# Altium schematic sheet PowerBoard_1.SchDoc: DriveHUB CardFrame - Backplane Power
size A3; Date: 01/08/22; Engineer: AJC; DocumentNumber: 35-735; Revision: D; SheetNumber: 1; SheetTotal: 3; Manager: AJC
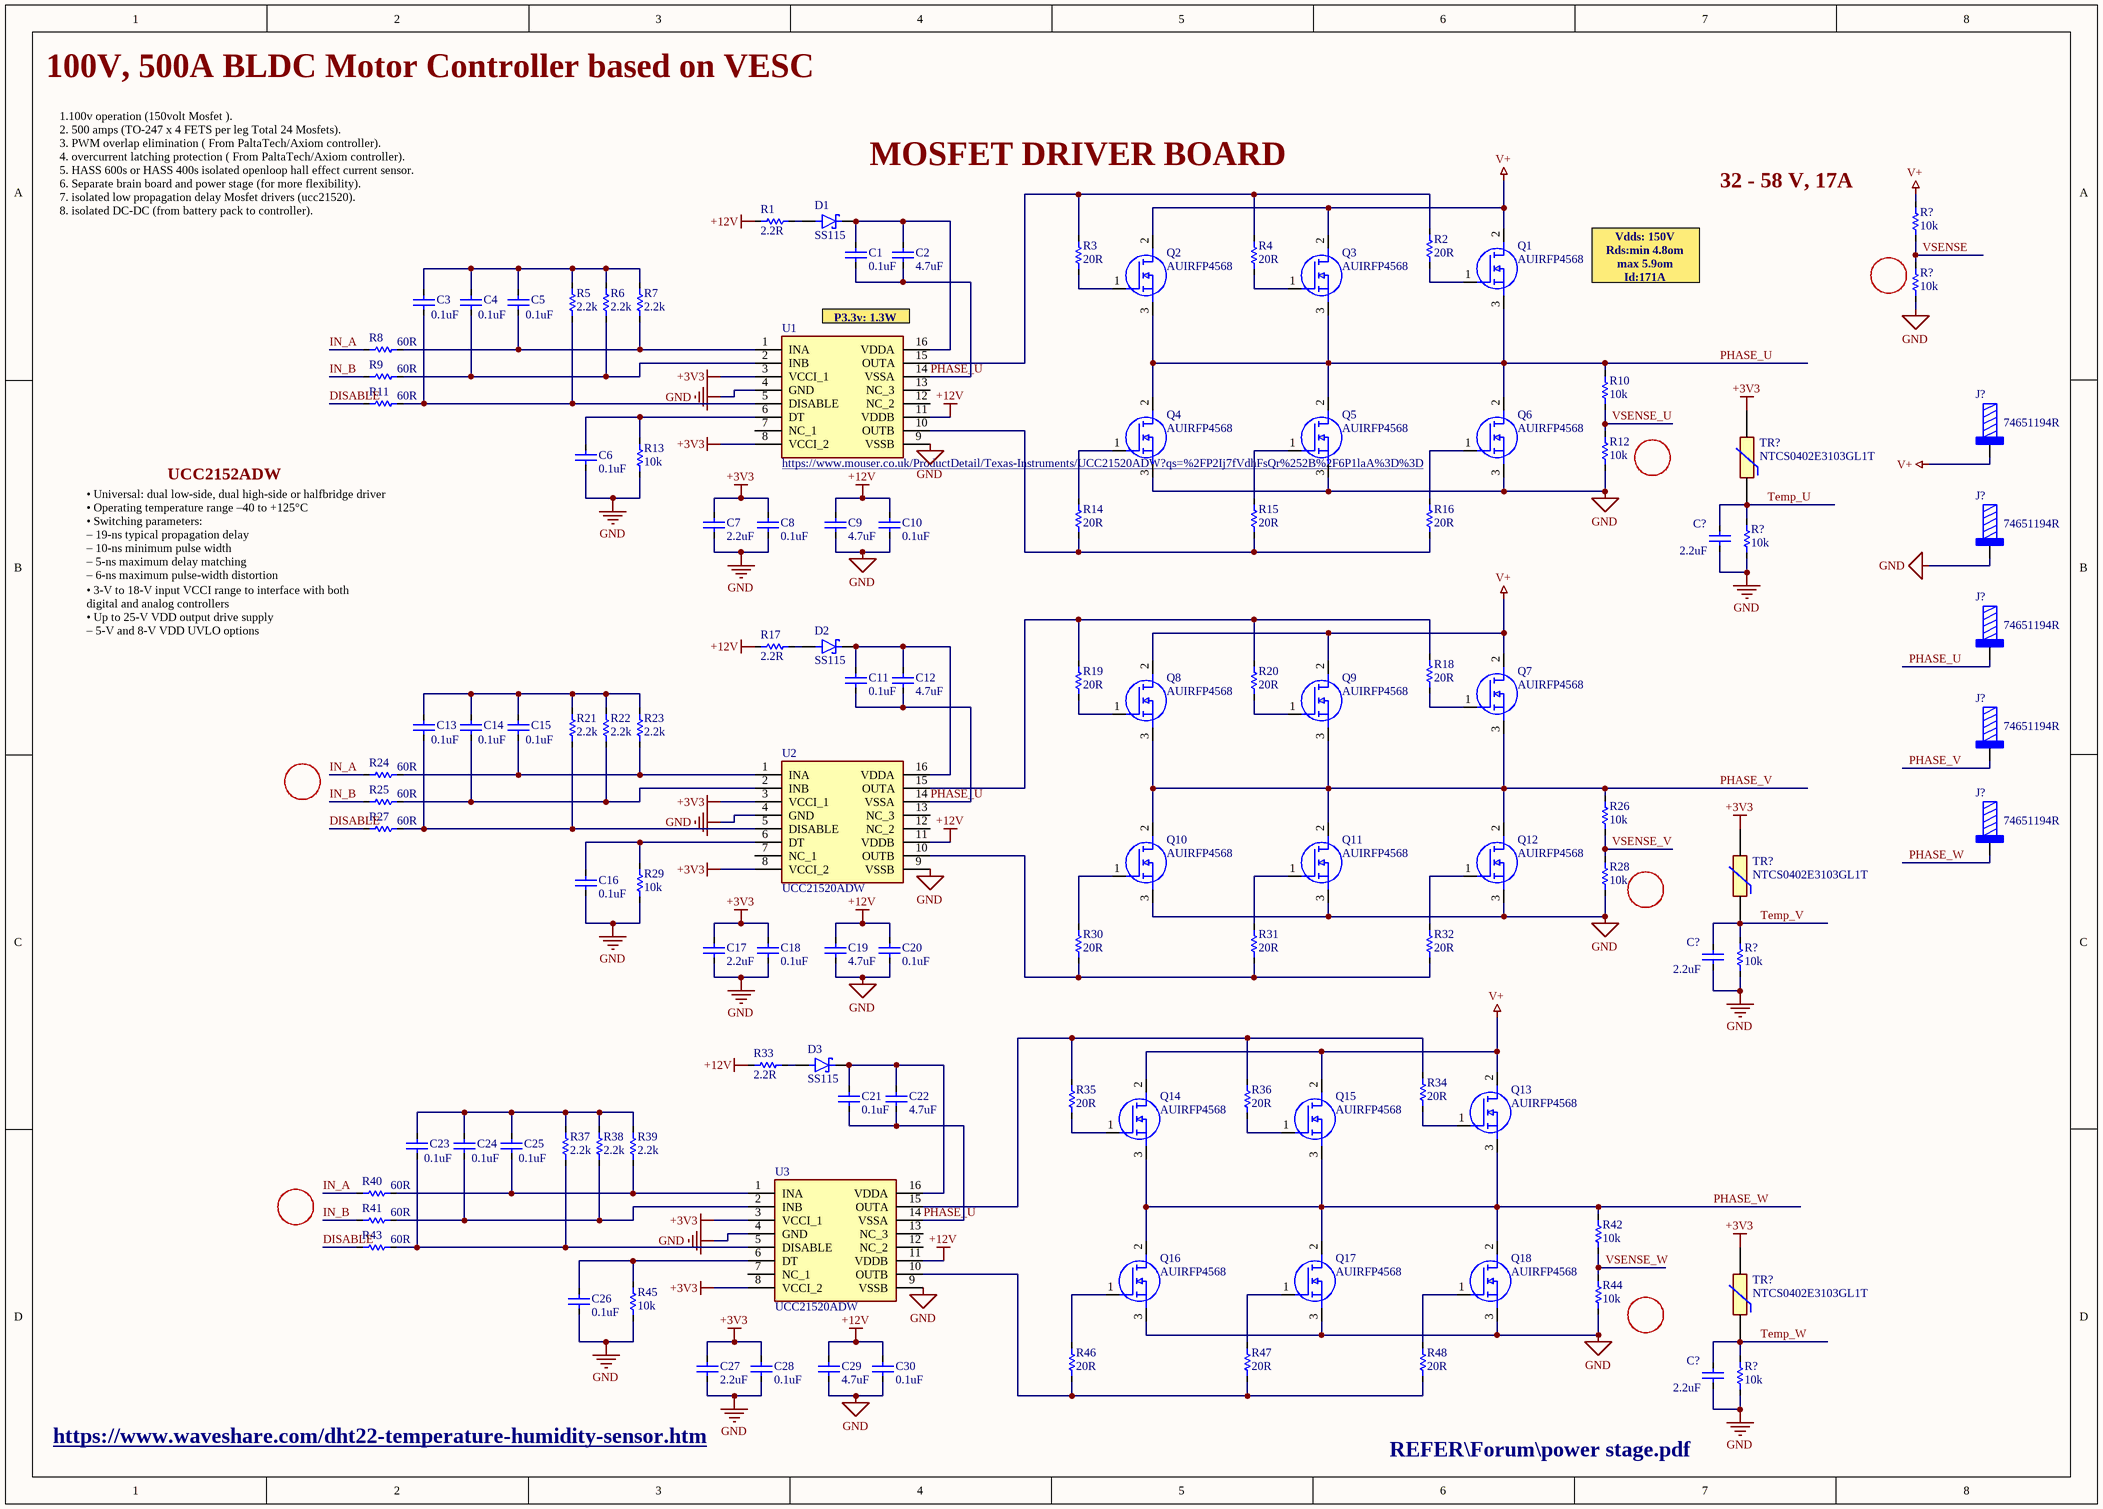
[diagram p0: PowerBoard_1.SchDoc]

## Parts
(Parts that share a designator on the sheet are numbered #1, #2 ... from top to bottom, then left to right.)
C1  0.1uF  [SMD_C(0402)]
C2  4.7uF  [SMD_C(0603)]
C3  0.1uF  [SMD_C(0402)]
C4  0.1uF  [SMD_C(0402)]
C5  0.1uF  [SMD_C(0402)]
C6  0.1uF  [SMD_C(0402)]
C7  2.2uF  [SMD_C(0603)]
C8  0.1uF  [SMD_C(0402)]
C9  4.7uF  [SMD_C(0603)]
C10  0.1uF  [SMD_C(0402)]
C11  0.1uF  [SMD_C(0402)]
C12  4.7uF  [SMD_C(0603)]
C13  0.1uF  [SMD_C(0402)]
C14  0.1uF  [SMD_C(0402)]
C15  0.1uF  [SMD_C(0402)]
C16  0.1uF  [SMD_C(0402)]
C17  2.2uF  [SMD_C(0603)]
C18  0.1uF  [SMD_C(0402)]
C19  4.7uF  [SMD_C(0603)]
C20  0.1uF  [SMD_C(0402)]
C21  0.1uF  [SMD_C(0402)]
C22  4.7uF  [SMD_C(0603)]
C23  0.1uF  [SMD_C(0402)]
C24  0.1uF  [SMD_C(0402)]
C25  0.1uF  [SMD_C(0402)]
C26  0.1uF  [SMD_C(0402)]
C27  2.2uF  [SMD_C(0603)]
C28  0.1uF  [SMD_C(0402)]
C29  4.7uF  [SMD_C(0603)]
C30  0.1uF  [SMD_C(0402)]
C?#1  2.2uF  [SMD_C(0402)]
C?#2  2.2uF  [SMD_C(0402)]
C?#3  2.2uF  [SMD_C(0402)]
D1  SS115  [DIOM4325X250N]
D2  SS115  [DIOM4325X250N]
D3  SS115  [DIOM4325X250N]
J?#1  74651194R  [74651194]
J?#2  74651194R  [74651194]
J?#3  74651194R  [74651194]
J?#4  74651194R  [74651194]
J?#5  74651194R  [74651194]
Q1  AUIRFP4568  [TO546P531X1558X2499-3P]
Q2  AUIRFP4568  [TO546P531X1558X2499-3P]
Q3  AUIRFP4568  [TO546P531X1558X2499-3P]
Q4  AUIRFP4568  [TO546P531X1558X2499-3P]
Q5  AUIRFP4568  [TO546P531X1558X2499-3P]
Q6  AUIRFP4568  [TO546P531X1558X2499-3P]
Q7  AUIRFP4568  [TO546P531X1558X2499-3P]
Q8  AUIRFP4568  [TO546P531X1558X2499-3P]
Q9  AUIRFP4568  [TO546P531X1558X2499-3P]
Q10  AUIRFP4568  [TO546P531X1558X2499-3P]
Q11  AUIRFP4568  [TO546P531X1558X2499-3P]
Q12  AUIRFP4568  [TO546P531X1558X2499-3P]
Q13  AUIRFP4568  [TO546P531X1558X2499-3P]
Q14  AUIRFP4568  [TO546P531X1558X2499-3P]
Q15  AUIRFP4568  [TO546P531X1558X2499-3P]
Q16  AUIRFP4568  [TO546P531X1558X2499-3P]
Q17  AUIRFP4568  [TO546P531X1558X2499-3P]
Q18  AUIRFP4568  [TO546P531X1558X2499-3P]
R1  2.2R  [SMD_R(0402)]
R2  20R  [SMD_R(0402)]
R3  20R  [SMD_R(0402)]
R4  20R  [SMD_R(0402)]
R5  2.2k  [SMD_R(0402)]
R6  2.2k  [SMD_R(0402)]
R7  2.2k  [SMD_R(0402)]
R8  60R  [SMD_R(0402)]
R9  60R  [SMD_R(0402)]
R10  10k  [SMD_R(0402)]
R11  60R  [SMD_R(0402)]
R12  10k  [SMD_R(0402)]
R13  10k  [SMD_R(0402)]
R14  20R  [SMD_R(0402)]
R15  20R  [SMD_R(0402)]
R16  20R  [SMD_R(0402)]
R17  2.2R  [SMD_R(0402)]
R18  20R  [SMD_R(0402)]
R19  20R  [SMD_R(0402)]
R20  20R  [SMD_R(0402)]
R21  2.2k  [SMD_R(0402)]
R22  2.2k  [SMD_R(0402)]
R23  2.2k  [SMD_R(0402)]
R24  60R  [SMD_R(0402)]
R25  60R  [SMD_R(0402)]
R26  10k  [SMD_R(0402)]
R27  60R  [SMD_R(0402)]
R28  10k  [SMD_R(0402)]
R29  10k  [SMD_R(0402)]
R30  20R  [SMD_R(0402)]
R31  20R  [SMD_R(0402)]
R32  20R  [SMD_R(0402)]
R33  2.2R  [SMD_R(0402)]
R34  20R  [SMD_R(0402)]
R35  20R  [SMD_R(0402)]
R36  20R  [SMD_R(0402)]
R37  2.2k  [SMD_R(0402)]
R38  2.2k  [SMD_R(0402)]
R39  2.2k  [SMD_R(0402)]
R40  60R  [SMD_R(0402)]
R41  60R  [SMD_R(0402)]
R42  10k  [SMD_R(0402)]
R43  60R  [SMD_R(0402)]
R44  10k  [SMD_R(0402)]
R45  10k  [SMD_R(0402)]
R46  20R  [SMD_R(0402)]
R47  20R  [SMD_R(0402)]
R48  20R  [SMD_R(0402)]
R?#1  10k  [SMD_R(0402)]
R?#2  10k  [SMD_R(0402)]
R?#3  10k  [SMD_R(0402)]
R?#4  10k  [SMD_R(0402)]
R?#5  10k  [SMD_R(0402)]
TR?#1  NTCS0402E3103GL1T  [THRMC1005X65N]
TR?#2  NTCS0402E3103GL1T  [THRMC1005X65N]
TR?#3  NTCS0402E3103GL1T  [THRMC1005X65N]
U1  https://www.mouser.co.uk/ProductDetail/Texas-Instruments/UCC21520ADW?qs=%2FP2Ij7fVdhFsQr%252B%2F6P1laA%3D%3D  [SOIC127P1030X265-16N]
U2  UCC21520ADW  [SOIC127P1030X265-16N]
U3  UCC21520ADW  [SOIC127P1030X265-16N]

## Nets
+3V3: C7.2 C8.2 C17.2 C18.2 C27.2 C28.2 TR?#1.2 TR?#2.2 TR?#3.2 U1.3(VCCI_1) U1.8(VCCI_2) U2.3(VCCI_1) U2.8(VCCI_2) U3.3(VCCI_1) U3.8(VCCI_2)
+12V: C9.2 C10.2 C19.2 C20.2 C29.2 C30.2 R1.1 R17.1 R33.1 U1.11(VDDB) U2.11(VDDB) U3.11(VDDB)
GND: C6.1 C7.1 C8.1 C9.1 C10.1 C16.1 C17.1 C18.1 C19.1 C20.1 C26.1 C27.1 C28.1 C29.1 C30.1 C?#1.1 C?#2.1 C?#3.1 J?#2.1 Q4.3(S) Q5.3(S) Q6.3(S) Q10.3(S) Q11.3(S) Q12.3(S) Q16.3(S) Q17.3(S) Q18.3(S) R12.1 R13.1 R28.1 R29.1 R44.1 R45.1 R?#2.1 R?#3.1 R?#4.1 R?#5.1 U1.4(GND) U1.9(VSSB) U2.4(GND) U2.9(VSSB) U3.4(GND) U3.9(VSSB)
V+: J?#1.1 Q1.2(D) Q2.2(D) Q3.2(D) Q7.2(D) Q8.2(D) Q9.2(D) Q13.2(D) Q14.2(D) Q15.2(D) R?#1.2
DISABLE: R11.1 R27.1 R43.1
IN_A: R8.1 R24.1 R40.1
IN_B: R9.1 R25.1 R41.1
PHASE_U: C1.1 C2.1 C11.1 C12.1 C21.1 C22.1 J?#3.1 Q1.3(S) Q2.3(S) Q3.3(S) Q4.2(D) Q5.2(D) Q6.2(D) R10.2 U1.14(VSSA) U2.14(VSSA) U3.14(VSSA)
PHASE_V: J?#4.1 Q7.3(S) Q8.3(S) Q9.3(S) Q10.2(D) Q11.2(D) Q12.2(D) R26.2
PHASE_W: J?#5.1 Q13.3(S) Q14.3(S) Q15.3(S) Q16.2(D) Q17.2(D) Q18.2(D) R42.2
Temp_U: C?#1.2 R?#3.2 TR?#1.1
Temp_V: C?#2.2 R?#4.2 TR?#2.1
Temp_W: C?#3.2 R?#5.2 TR?#3.1
VSENSE: R?#1.1 R?#2.2
VSENSE_U: R10.1 R12.2
VSENSE_V: R26.1 R28.2
VSENSE_W: R42.1 R44.2
NetC1_2: C1.2 C2.2 D1.C(K) U1.16(VDDA)
NetC3_1: C3.1 R5.1 R11.2 U1.5(DISABLE)
NetC3_2: C3.2 C4.2 C5.2 R5.2 R6.2 R7.2
NetC4_1: C4.1 R6.1 R9.2 U1.2(INB)
NetC5_1: C5.1 R7.1 R8.2 U1.1(INA)
NetC6_2: C6.2 R13.2 U1.6(DT)
NetC11_2: C11.2 C12.2 D2.C(K) U2.16(VDDA)
NetC13_1: C13.1 R21.1 R27.2 U2.5(DISABLE)
NetC13_2: C13.2 C14.2 C15.2 R21.2 R22.2 R23.2
NetC14_1: C14.1 R22.1 R25.2 U2.2(INB)
NetC15_1: C15.1 R23.1 R24.2 U2.1(INA)
NetC16_2: C16.2 R29.2 U2.6(DT)
NetC21_2: C21.2 C22.2 D3.C(K) U3.16(VDDA)
NetC23_1: C23.1 R37.1 R43.2 U3.5(DISABLE)
NetC23_2: C23.2 C24.2 C25.2 R37.2 R38.2 R39.2
NetC24_1: C24.1 R38.1 R41.2 U3.2(INB)
NetC25_1: C25.1 R39.1 R40.2 U3.1(INA)
NetC26_2: C26.2 R45.2 U3.6(DT)
NetD1_A: D1.A R1.2
NetD2_A: D2.A R17.2
NetD3_A: D3.A R33.2
NetQ1_1: Q1.1(G) R2.1
NetQ2_1: Q2.1(G) R3.1
NetQ3_1: Q3.1(G) R4.1
NetQ4_1: Q4.1(G) R14.2
NetQ5_1: Q5.1(G) R15.2
NetQ6_1: Q6.1(G) R16.2
NetQ7_1: Q7.1(G) R18.1
NetQ8_1: Q8.1(G) R19.1
NetQ9_1: Q9.1(G) R20.1
NetQ10_1: Q10.1(G) R30.2
NetQ11_1: Q11.1(G) R31.2
NetQ12_1: Q12.1(G) R32.2
NetQ13_1: Q13.1(G) R34.1
NetQ14_1: Q14.1(G) R35.1
NetQ15_1: Q15.1(G) R36.1
NetQ16_1: Q16.1(G) R46.2
NetQ17_1: Q17.1(G) R47.2
NetQ18_1: Q18.1(G) R48.2
NetR2_2: R2.2 R3.2 R4.2 U1.15(OUTA)
NetR14_1: R14.1 R15.1 R16.1 U1.10(OUTB)
NetR18_2: R18.2 R19.2 R20.2 U2.15(OUTA)
NetR30_1: R30.1 R31.1 R32.1 U2.10(OUTB)
NetR34_2: R34.2 R35.2 R36.2 U3.15(OUTA)
NetR46_1: R46.1 R47.1 R48.1 U3.10(OUTB)

Not connected (* = marked no-connect by the designer): U1 7(NC_1) 12(NC_2) 13(NC_3); U2 7(NC_1) 12(NC_2) 13(NC_3); U3 7(NC_1) 12(NC_2) 13(NC_3)

## Notes on the sheet
- 100V, 500A BLDC Motor Controller based on VESC
- MOSFET DRIVER BOARD
- 1.100v operation (150volt Mosfet ).
  2. 500 amps (TO-247 x 4 FETS per leg Total 24 Mosfets).
  3. PWM overlap elimination ( From PaltaTech/Axiom controller).
  4. overcurrent latching protection ( From PaltaTech/Axiom controller).
  5. HASS 600s or HASS 400s isolated openloop hall effect current sensor.
  6. Separate brain board and power stage (for more flexibility).
  7. isolated low propagation delay Mosfet drivers (ucc21520).
  8. isolated DC-DC (from battery pack to controller).
- (near R?#1) 32 - 58 V, 17A
- (near U1) P3.3v: 1.3W
- Vdds: 150V
  Rds:min 4.8om
  max 5.9om
  Id:171A
- UCC2152ADW
- • Universal: dual low-side, dual high-side or halfbridge driver
  • Operating temperature range –40 to +125°C
  • Switching parameters:
  – 19-ns typical propagation delay
  – 10-ns minimum pulse width
  – 5-ns maximum delay matching
  – 6-ns maximum pulse-width distortion
- • 3-V to 18-V input VCCI range to interface with both
  digital and analog controllers
  • Up to 25-V VDD output drive supply
  – 5-V and 8-V VDD UVLO options
- https://www.waveshare.com/dht22-temperature-humidity-sensor.htm
- REFER\Forum\power stage.pdf

## Library data of the parts
C1 C3-C6 C8 C10 C11 C13-C16 C18 C20 C21 C23-C26 C28 C30 = Cap_1: Multilayer Ceramic Capacitors MLCC - SMD/SMT 50 V 0.1uF X7R 0603 10%; Manufacturer: Yageo; Manufacturer Part Number: CC0603KPX7R9BB104; Supplier 1: Digi-Key; Supplier Part Number 1: 311-3567-1-ND
C2 C7 C9 C12 C17 C19 C22 C27 C29 = Cap_10: PHE840MA6100MA04R17; Manufacturer: Yageo; Manufacturer Part Number: CC0603KPX7R9BB104; Supplier 1: Digi-Key; Supplier Part Number 1: 311-3567-1-ND
C?#1-C?#3 = Cap_1: Multilayer Ceramic Capacitors MLCC - SMD/SMT 50 V 0.1uF X7R 0603 10%
D1-D3 = SS115: 1A, 150V, Schottky Rectifier; MF: Taiwan Semiconductor; Package: DO-214AC-2 Taiwan Semiconductor; Check_prices: https://www.snapeda.com/parts/SS115/Taiwan+Semiconductor/view-part/?ref=eda; Value: *; Price: None; Purchase-URL: https://pricing.snapeda.com/search/part/SS115/?ref=eda; MP: SS115; SnapEDA_Link: https://www.snapeda.com/parts/SS115/Taiwan+Semiconductor/view-part/?ref=snap; Availability: In Stock
J?#1-J?#5 = 74651194R: WP-THRSH REDCUBE THR with external thread, M4 x 5mm, 85A; Manufacturer: Wurth Elektronik; Surface: Tin; ComponentLink1Description: Website Link; ComponentLink1URL: https://www.we-online.com/redexpert/article/74651194R?ad; ComponentLink2Description: Datasheet Link; ComponentLink2URL: https://www.we-online.com/redexpert/spec/74651194R?ad; Manufacturer Part Number: 74651194R; Category: REDCUBE THR; Match Code: WP-THRSH; Mount: Through Hole Reflow; Operating Temperature Max: 150°C; Operating Temperature Min: -55°C; Packaging: Tape and Reel; Length: 10mm; Width: 10mm; Height: 8.5mm; Material: Brass; Number of Pins: 9; Rated Current: 85A; Thread Length: 5mm; Thread Size: M4; Supplier: Mouser; Supplier Part Number: 710-74651195R; Price: 3.5; Value: 74651194R
Q1-Q18 = AUIRFP4568: MOSFET N-CHANNEL 100+; Manufacturer_Name: Infineon; Geometry.Height: 5.31mm; Mouser Part Number: 942-AUIRFP4568; Mouser Price/Stock: https://www.mouser.co.uk/ProductDetail/Infineon-IR/AUIRFP4568?qs=m1T3c8F5IUIdoWYie9aRBg%3D%3D; Manufacturer_Part_Number: AUIRFP4568; Datasheet Link: https://www.infineon.com/dgdl/auirfp4568.pdf?fileId=5546d462533600a4015355b1d8751458
R1-R4 R8 R9 R11 R14-R20 R24 R25 R27 R30-R36 R40 R41 R43 R46-R48 = Res Semi_1: CRCW04024R02FKED; Published: 8-Jun-2000; LatestRevisionDate: 17-Jul-2002; LatestRevisionNote: Re-released for DXP Platform.; PackageReference: AXIAL-0.5; Publisher: Altium Limited; PackageDescription: Axial Device, Thru-Hole; 2 Leads; 0.5 in Pin Spacing
R5-R7 R21-R23 R37-R39 = Res Semi_2: CRCW04024R02FKED; Published: 8-Jun-2000; LatestRevisionDate: 17-Jul-2002; LatestRevisionNote: Re-released for DXP Platform.; PackageReference: AXIAL-0.5; Publisher: Altium Limited; PackageDescription: Axial Device, Thru-Hole; 2 Leads; 0.5 in Pin Spacing
R10 R12 R13 R26 R28 R29 R42 R44 R45 R?#1-R?#5 = Res Semi_5: CRCW04024R02FKED; Published: 8-Jun-2000; LatestRevisionDate: 17-Jul-2002; LatestRevisionNote: Re-released for DXP Platform.; PackageReference: AXIAL-0.5; Publisher: Altium Limited; PackageDescription: Axial Device, Thru-Hole; 2 Leads; 0.5 in Pin Spacing
TR?#1-TR?#3 = NTCS0402E3103GL1T: NTC Thermistors 10Kohms 2% AEC-Q200; Manufacturer_Name: Vishay; Geometry.Height: 0.65mm; Mouser Part Number: 594-NTCS402E3103GL1T; Mouser Price/Stock: https://www.mouser.co.uk/ProductDetail/Vishay-BC-Components/NTCS0402E3103GL1T?qs=u16ybLDytRYI8lwq3wWutw%3D%3D; Manufacturer_Part_Number: NTCS0402E3103GL1T; Datasheet Link: https://www.mouser.in/datasheet/2/427/ntcs0402e3t-1762119.pdf
U1 = UCC21520ADW: 4A/6A, 5.7 kVrms Isolated Dual Channel Gate Driver; Manufacturer: Texas Instruments; Supplier Part Number: 595-UCC21520ADW; Value: https://www.mouser.co.uk/ProductDetail/Texas-Instruments/UCC21520ADW?qs=%2FP2Ij7fVdhFsQr%252B%2F6P1laA%3D%3D; Manufacturer Part Number: UCC21520ADW; Price: http://www.ti.com/lit/gpn/ucc21520; Supplier: 2.65mm
U2 U3 = UCC21520ADW: 4A/6A, 5.7 kVrms Isolated Dual Channel Gate Driver; Manufacturer_Name: Texas Instruments; Geometry.Height: 2.65mm; Mouser Part Number: 595-UCC21520ADW; Mouser Price/Stock: https://www.mouser.co.uk/ProductDetail/Texas-Instruments/UCC21520ADW?qs=%2FP2Ij7fVdhFsQr%252B%2F6P1laA%3D%3D; Manufacturer_Part_Number: UCC21520ADW; Datasheet Link: http://www.ti.com/lit/gpn/ucc21520